# Altium project SN74CBTD3861DW.PrjPcb
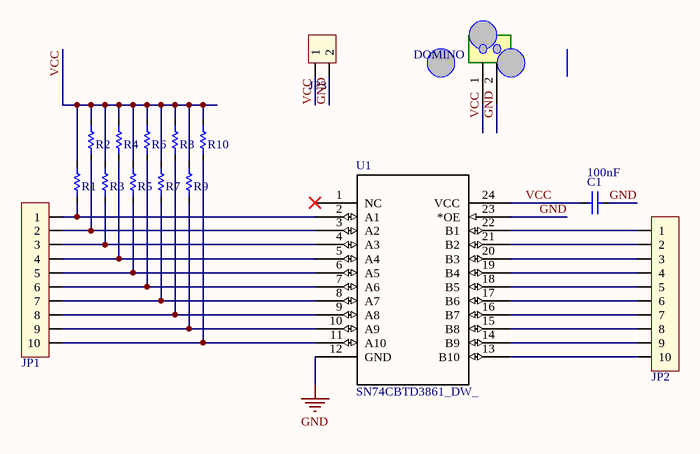
[diagram p0: LV.SchDoc]
1 sheet, 16 parts. Net scope: global (net labels, ports and power ports of the same name join across sheets).
Board file: LV.PcbDoc

## Sheet LV.SchDoc: LevelShifting
size A; DrawnBy: Mr. Thach; Revision: Rev 1.0

### Parts
C1  100nF  [0805_C]
D1  DOMINO  [DOMINO2]
JP1  JP10  [HEAD10]  (value not drawn)
JP2  JP10  [HEAD10]  (value not drawn)
JP3  JP2  [HEAD2]  (value not drawn)
R1  0805_R  [0805_R]  (value not drawn)
R2  0805_R  [0805_R]  (value not drawn)
R3  0805_R  [0805_R]  (value not drawn)
R4  0805_R  [0805_R]  (value not drawn)
R5  0805_R  [0805_R]  (value not drawn)
R6  0805_R  [0805_R]  (value not drawn)
R7  0805_R  [0805_R]  (value not drawn)
R8  0805_R  [0805_R]  (value not drawn)
R9  0805_R  [0805_R]  (value not drawn)
R10  0805_R  [0805_R]  (value not drawn)
U1  SN74CBTD3861_DW_  [DW24-M]

### Nets
GND: C1.2 D1.2 JP3.2 U1.12(GND) U1.23(*OE)
VCC: C1.1 D1.1 JP3.1 R1.1 R2.1 R3.1 R4.1 R5.1 R6.1 R7.1 R8.1 R9.1 R10.1 U1.24(VCC)
NetJP1_1: JP1.1 R1.2 U1.2(A1)
NetJP1_2: JP1.2 R2.2 U1.3(A2)
NetJP1_3: JP1.3 R3.2 U1.4(A3)
NetJP1_4: JP1.4 R4.2 U1.5(A4)
NetJP1_5: JP1.5 R5.2 U1.6(A5)
NetJP1_6: JP1.6 R6.2 U1.7(A6)
NetJP1_7: JP1.7 R7.2 U1.8(A7)
NetJP1_8: JP1.8 R8.2 U1.9(A8)
NetJP1_9: JP1.9 R9.2 U1.10(A9)
NetJP1_10: JP1.10 R10.2 U1.11(A10)
NetJP2_1: JP2.1 U1.22(B1)
NetJP2_2: JP2.2 U1.21(B2)
NetJP2_3: JP2.3 U1.20(B3)
NetJP2_4: JP2.4 U1.19(B4)
NetJP2_5: JP2.5 U1.18(B5)
NetJP2_6: JP2.6 U1.17(B6)
NetJP2_7: JP2.7 U1.16(B7)
NetJP2_8: JP2.8 U1.15(B8)
NetJP2_9: JP2.9 U1.14(B9)
NetJP2_10: JP2.10 U1.13(B10)

Not connected (* = marked no-connect by the designer): U1 1(NC)*

### Library data of the parts
C1 = C: 0805 SMD capacitor
D1 = Domino 2
JP1 JP2 = HEAD10: Connector 10; Value: Connector 10
JP3 = HEAD2: Connector 2; Value: Connector 2
R1-R10 = 0805_R: 0805 SMD resistor
U1 = SN74CBTD3861_DW_: Imported; Manufacturer: Texas Instruments; Manufacturer_Part_Number: sn74cbtd3861_dw_24; INDUSTRY_STD_PKG_TYPE: SOIC; FAMILY_NAME: TRANSLATING BUS SWITCH; PIN_COUNT: 24; PACKAGE_DESIGNATOR: DW; Datasheet URL: http://www.ti.com/lit/gpn/SN74CBTD3861; GENERIC_PART_NUMBER: SN74CBTD3861; Vendor: Texas Instruments; RefDes: RefDes; Type: DEV; Value: Value